# EAGLE design SmartGardenController (EAGLE 5.11)
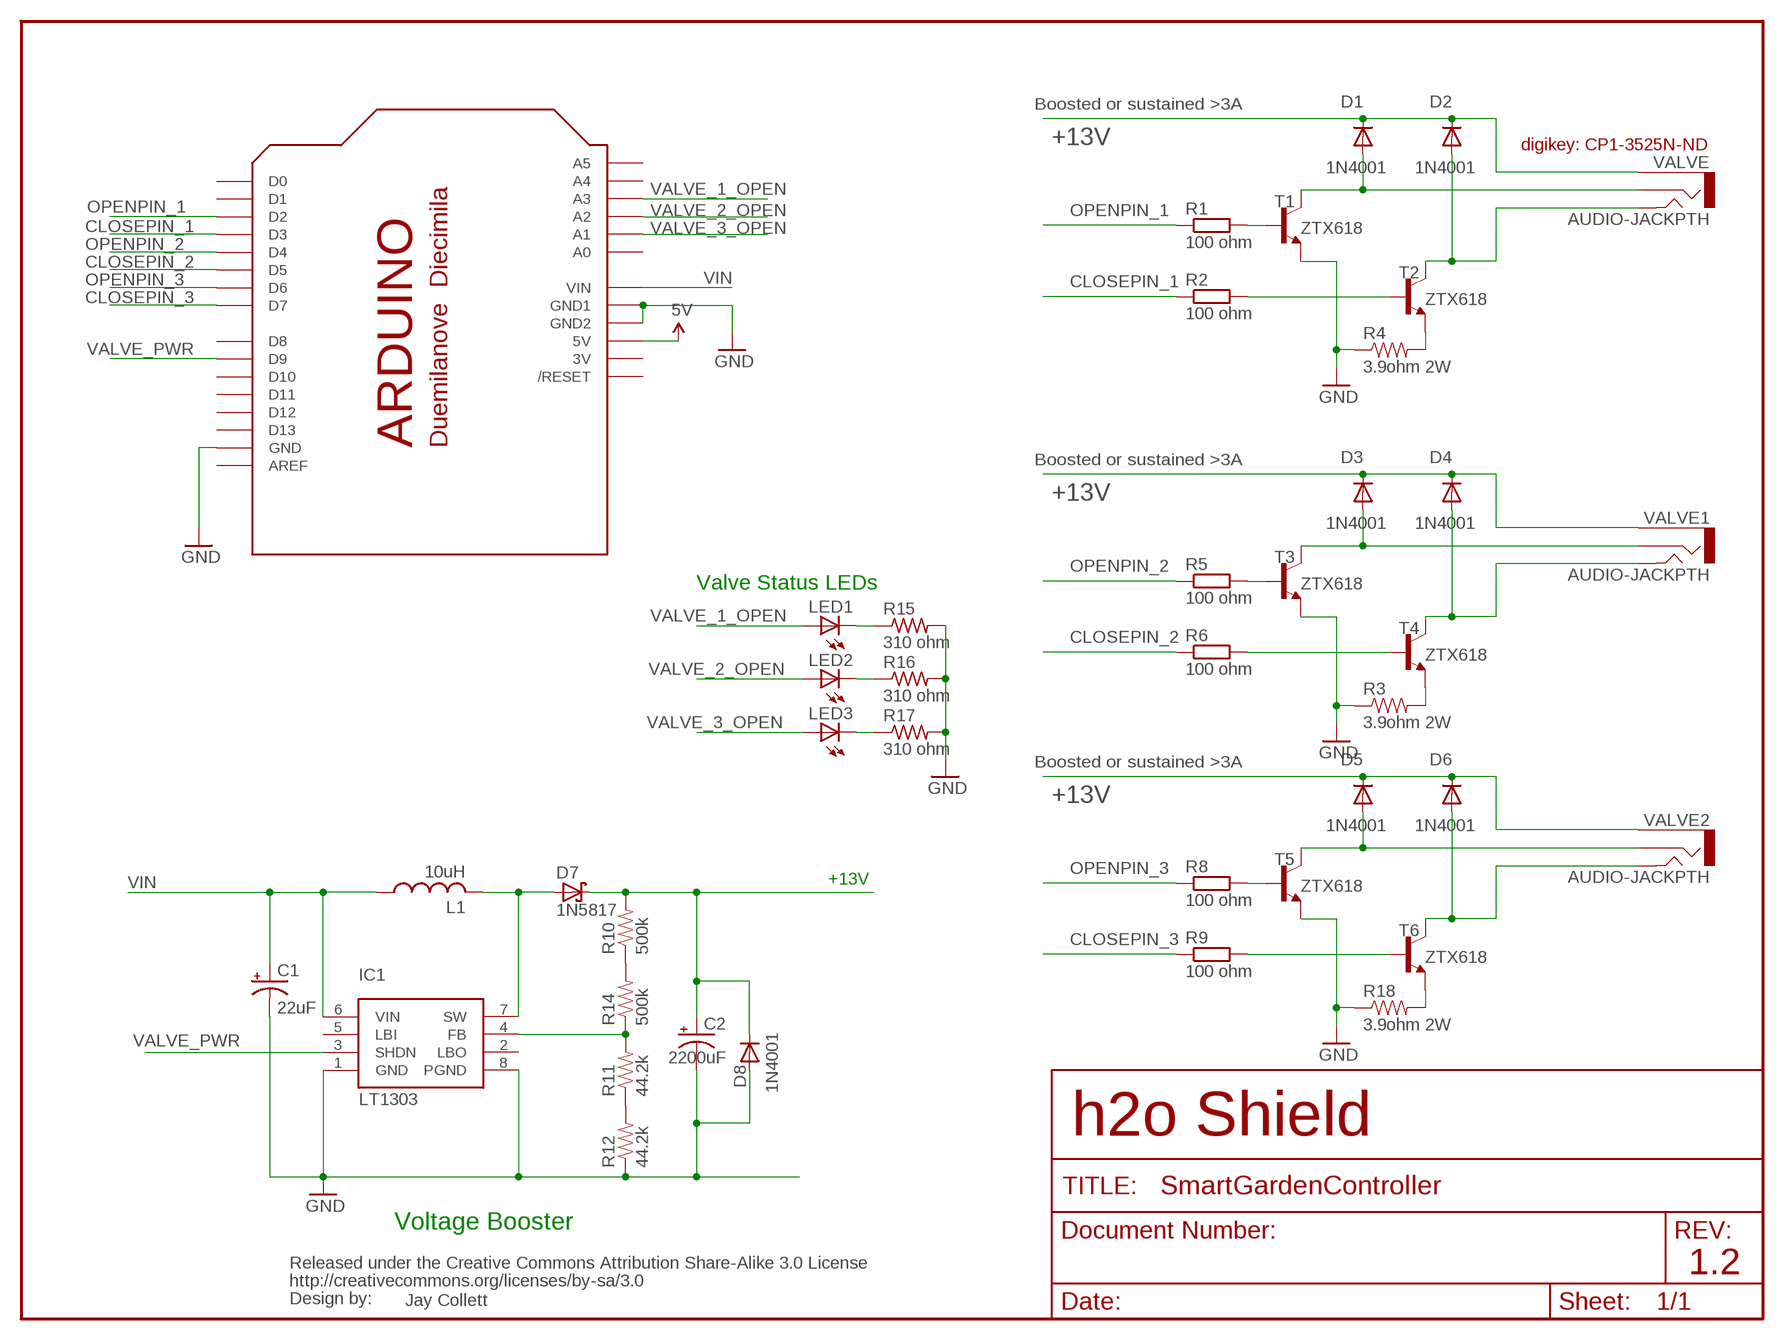
[diagram p0: schematic, sheet 1]

## Parts
C1  22uF  CPOL-USE2.5-5  [E2,5-5]
C2  2200uF  CPOL-USE5-13  [E5-13]
D1  1N4001  DIODEPTH  [DIODE-1N4001]
D2  1N4001  DIODEPTH  [DIODE-1N4001]
D3  1N4001  DIODEPTH  [DIODE-1N4001]
D4  1N4001  DIODEPTH  [DIODE-1N4001]
D5  1N4001  DIODEPTH  [DIODE-1N4001]
D6  1N4001  DIODEPTH  [DIODE-1N4001]
D7  1N5817  1N5817-T  [DO41-7.6]
D8  1N4001  1N4004  [DO41-10]
IC1  LT1303  [DIL08]
L1  10uH  L-US6000-XXX-RC  [6000-XXXX-RC]
LED1  LED0603  [LED-0603]
LED2  LED0603  [LED-0603]
LED3  LED0603  [LED-0603]
R1  100 ohm  R-EU_0204/7  [0204/7]
R2  100 ohm  R-EU_0204/7  [0204/7]
R3  3.9ohm 2W  RESISTORPTH-1W  [AXIAL-0.6]
R4  3.9ohm 2W  RESISTORPTH-1W  [AXIAL-0.6]
R5  100 ohm  R-EU_0204/7  [0204/7]
R6  100 ohm  R-EU_0204/7  [0204/7]
R8  100 ohm  R-EU_0204/7  [0204/7]
R9  100 ohm  R-EU_0204/7  [0204/7]
R10  500k  RESISTORAXIAL-0.3  [AXIAL-0.3]
R11  44.2k  RESISTORAXIAL-0.3  [AXIAL-0.3]
R12  44.2k  RESISTORAXIAL-0.3  [AXIAL-0.3]
R14  500k  RESISTORAXIAL-0.3  [AXIAL-0.3]
R15  310 ohm  R-US_0207/2V  [0207/2V]
R16  310 ohm  R-US_0207/2V  [0207/2V]
R17  310 ohm  R-US_0207/2V  [0207/2V]
R18  3.9ohm 2W  RESISTORPTH-1W  [AXIAL-0.6]
T1  ZTX618  2N2222  [TO92-EBC-OVAL]
T2  ZTX618  2N2222  [TO92-EBC-OVAL]
T3  ZTX618  2N2222  [TO92-EBC-OVAL]
T4  ZTX618  2N2222  [TO92-EBC-OVAL]
T5  ZTX618  2N2222  [TO92-EBC-OVAL]
T6  ZTX618  2N2222  [TO92-EBC-OVAL]
U$3  ARDUINOUNO  [ARDUINO]
U$4  CREATIVE_COMMONS  [CREATIVE_COMMONS]
VALVE  AUDIO-JACKPTH  [AUDIO-JACK]
VALVE1  AUDIO-JACKPTH  [AUDIO-JACK]
VALVE2  AUDIO-JACKPTH  [AUDIO-JACK]

## Nets
5V: U$3.5V
+13V [power]: C2.+ D1.C D2.C D3.C D4.C D5.C D6.C D7.C D8.C R10.P$2 VALVE1.1 VALVE2.1 VALVE.1
CLOSEPIN_1: R2.1 U$3.D3
CLOSEPIN_2: R6.1 U$3.D5
CLOSEPIN_3: R9.1 U$3.D7
GND [power]: C1.- C2.- D8.A IC1.1(GND) IC1.8(PGND) R3.P$1 R4.P$1 R12.P$1 R15.2 R16.2 R17.2 R18.P$1 T1.E T3.E T5.E U$3.GND U$3.GND1 U$3.GND2
N$1: D4.A T4.C VALVE1.5
N$2: D3.A T3.C VALVE1.2
N$3: R3.P$2 T4.E
N$4: R5.2 T3.B
N$5: R6.2 T4.B
N$6: D6.A T6.C VALVE2.5
N$7: D5.A T5.C VALVE2.2
N$8: D1.A T1.C VALVE.2
N$9: D2.A T2.C VALVE.5
N$10: R18.P$2 T6.E
N$11: R1.2 T1.B
N$12: R2.2 T2.B
N$13: R8.2 T5.B
N$14: R9.2 T6.B
N$15: R4.P$2 T2.E
N$16: IC1.4(FB) R11.P$2 R14.P$1
N$17: R10.P$1 R14.P$2
N$18: D7.A IC1.7(SW) L1.2
N$19: R11.P$1 R12.P$2
N$24: LED1.C R15.1
N$26: LED2.C R16.1
N$27: LED3.C R17.1
OPENPIN_1: R1.1 U$3.D2
OPENPIN_2: R5.1 U$3.D4
OPENPIN_3: R8.1 U$3.D6
VALVE_1_OPEN: LED1.A U$3.A3
VALVE_2_OPEN: LED2.A U$3.A2
VALVE_3_OPEN: LED3.A U$3.A1
VALVE_PWR: IC1.3(SHDN) U$3.D9
VIN: C1.+ IC1.6(VIN) L1.1 U$3.VIN
Unconnected: IC1.2(LBO) IC1.5(LBI) U$3.A0 U$3.A4 U$3.A5 U$3.AREF U$3.D0 U$3.D1 U$3.D8 U$3.D10 U$3.D11 U$3.D12 U$3.D13 U$3.RESET(/RESET)

## Notes on the sheet
- Boosted or sustained >3A
- digikey: CP1-3525N-ND
- Boosted or sustained >3A
- Valve Status LEDs
- Boosted or sustained >3A
- +13V
- h2o Shield
- Voltage Booster
- 1.2
- Jay Collett

## Power pins joined to a net without a drawn wire
3V: U$3.3V

## Library data of the parts
C1 C2 = rcl:CPOL-US: POLARIZED CAPACITOR, American symbol
D1-D6 = SparkFun:DIODE: Diode These are standard reverse protection diodes and small signal diodes. SMA package can handle up to about 1A. SOD-323 can handle about 200mA. What the SOD-323 package when ordering, there are some mfgs out there that are 5-pin packages.
D7 = diode:1N581*: 1.0A SCHOTTKY BARRIER RECTIFIER Source: http://www.diodes.com/datasheets/ds23001.pdf
D8 = diode:1N4004: DIODE general purpose rectifier, 1 A
IC1 = linear-technology:LT1303: LT1303 Micropower High Efficiency DC/DC Converter Source: http://www.linear.com/pc/downloadDocument.do?navId=H0,C1,C1003,C1042,C1031,C1061,P1035,D2445
L1 = rcl:L-US: INDUCTOR, American symbol
LED1-LED3 = SparkFun:LED: LEDs Standard schematic elements and footprints for 5mm, 3mm, 1206, and 0603 sized LEDs. 5mm - Spark Fun Electronics SKU : COM-00529 (and others)
R1 R2 R5 R6 R8 R9 = rcl:R-EU_: RESISTOR, European symbol
R3 R4 R10-R12 R14 R18 = SparkFun:RESISTOR: Resistor Basic schematic elements and footprints for 0603, 1206, and PTH resistors.
R15-R17 = adafruit:R-US_: RESISTOR, American symbol
T1-T6 = adafruit:2N2222: NPN TRANSISTOR Big oval pads
U$3 = adafruit:ARDUINO: Arduino Diecimila/Duemilanove Make a shield with ease, this package has all the named pins as well as the two mounting drill holes and an outline of the USB and DC power connector. The outline is on the DIMENSION layer, so if your board house uses it they will cut the outline to match. http://www.ladyada.net/library/pcb/eaglelibrary.html
U$4 = SparkFun:CREATIVE_COMMONS
VALVE VALVE1 VALVE2 = SparkFun:AUDIO-JACK: 3.5mm Audio Jack Simple 3.5mm common PCB mount audio jack. SKU: PRT-08032

## Net classes
0 default: width 0.406 mm, clearance 0.203 mm
1 power: width 0.61 mm, clearance 0.203 mm

## Board
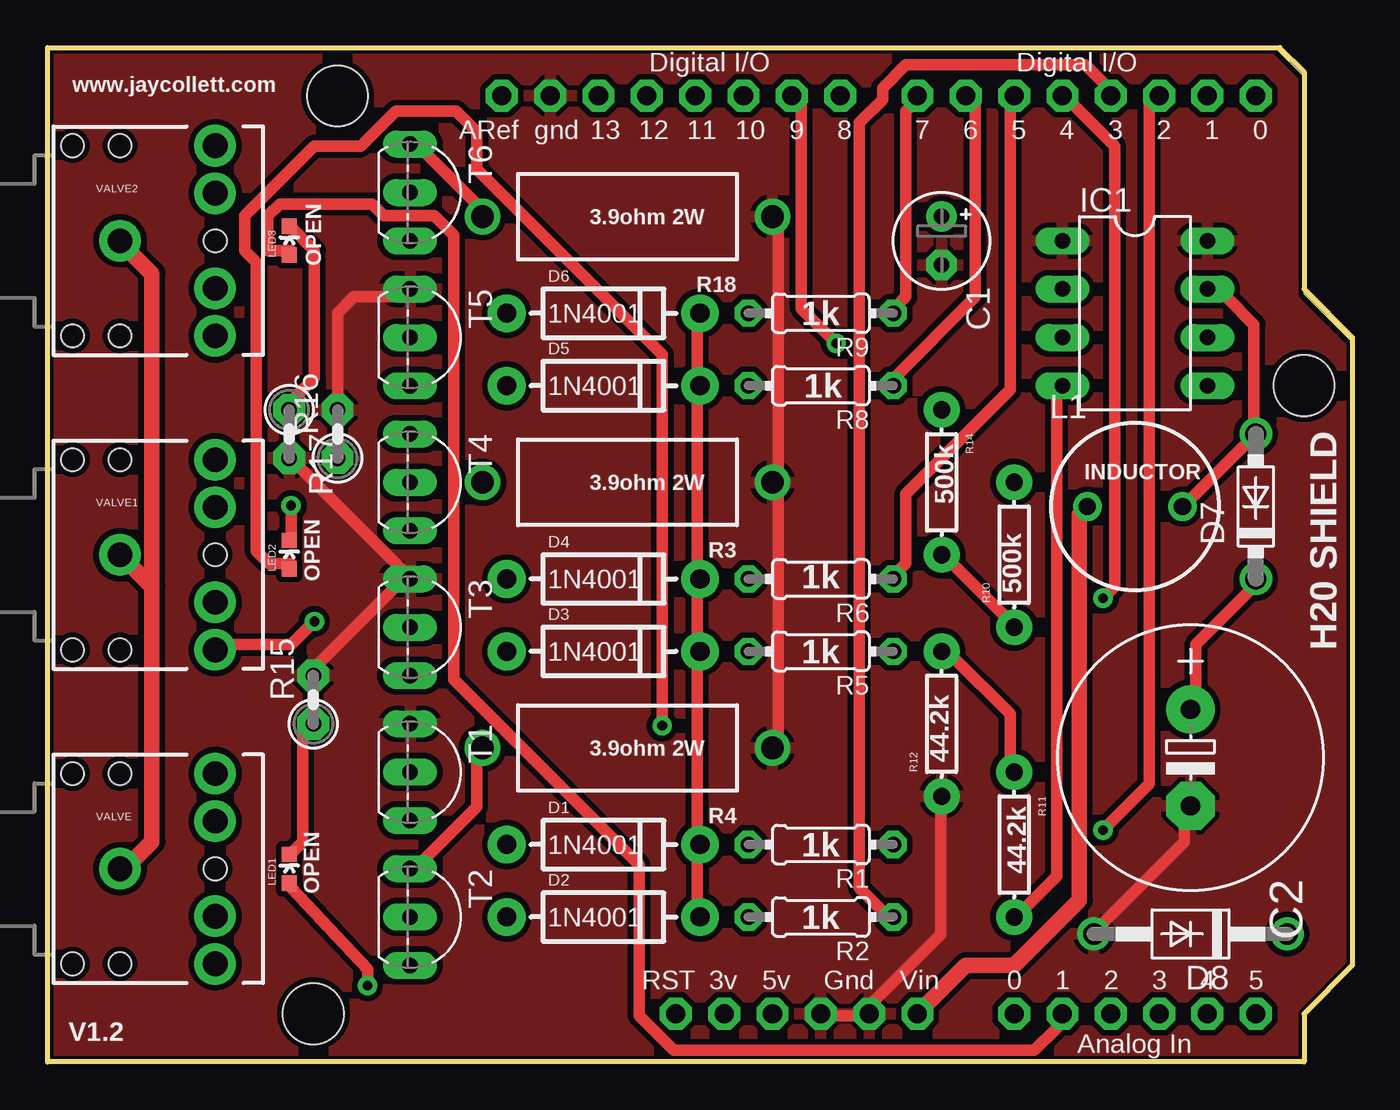
[diagram p1: board, top side]
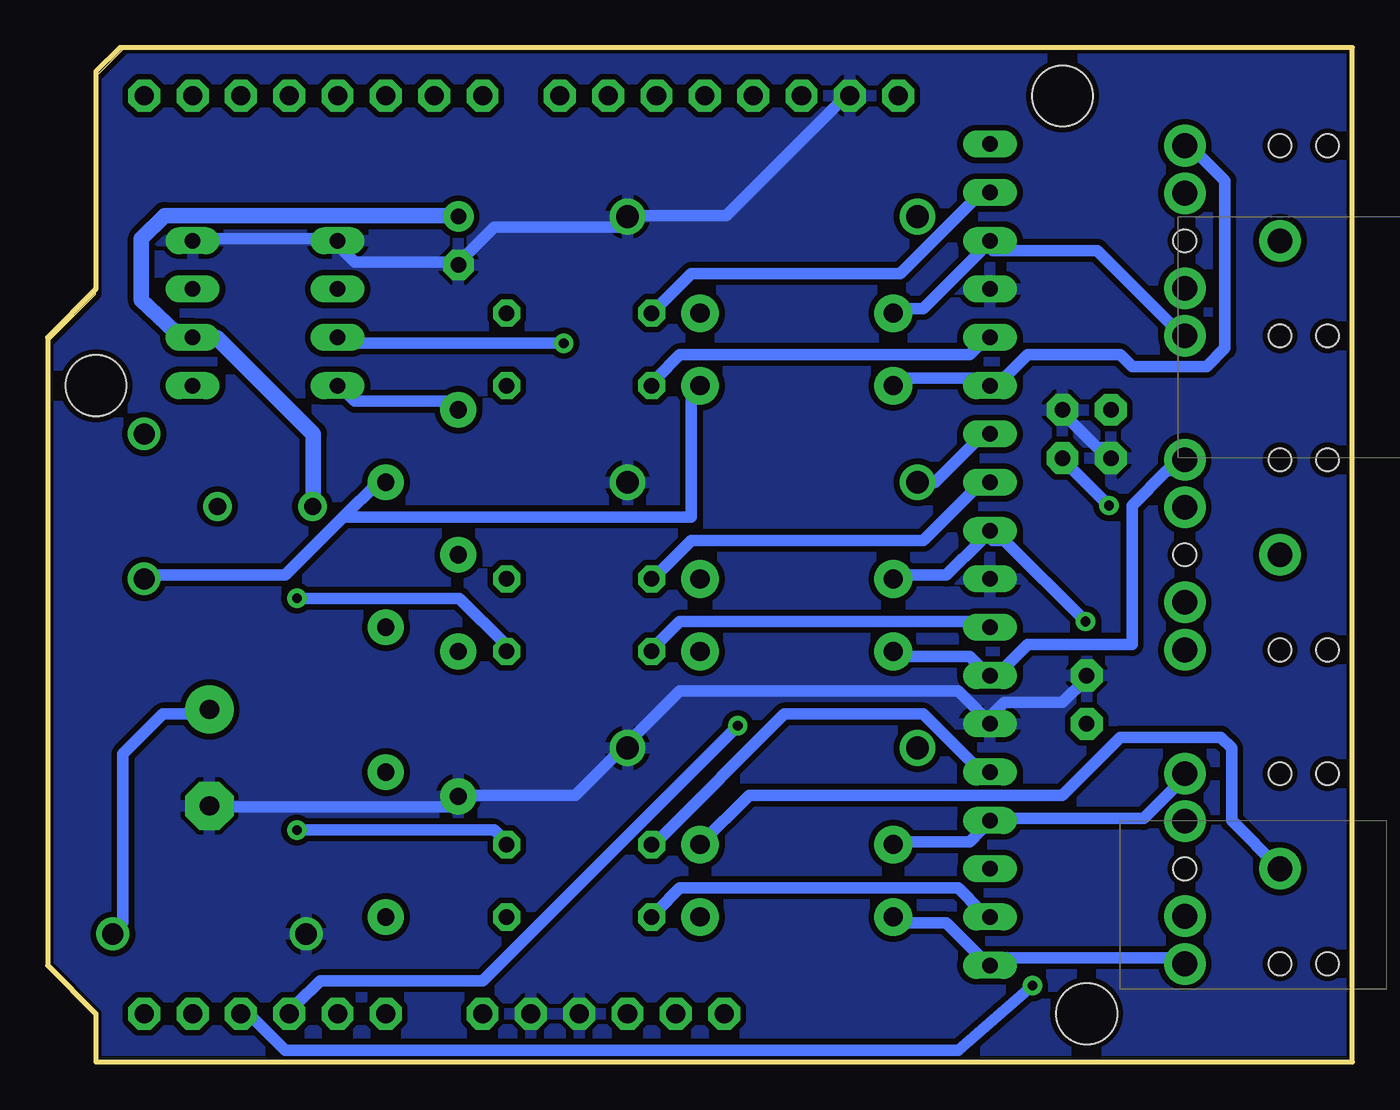
[diagram p2: board, bottom side, seen from below]

Size 68.58 x 53.34 mm. Coordinates in mm from the lower left corner, seen from the top.
Copper layers (1*16): Top 0.035mm / dielectric 1.5mm / Bottom 0.035mm
Design rules "SparkFun *": minimum track width 24mil, minimum drill 20mil, track to track 8mil, track to pad 8mil, pad to pad 8mil, via to via 8mil, smd to smd 8mil, copper to edge 10mil, drill to drill 8mil, minimum pad ring 12mil, minimum via ring 10mil, stop-mask expansion 4mil, vias tented up to drill 25mil, thermal gap 10mil
Milling: 9 lines

### Footprints (pad centres in the part's own frame; a part is rotated, then mirrored left to right if it is on the bottom)
E2,5-5 = drill 0.813 pad 1.6 round: + -1.27,0 | drill 0.813 pad 1.6 octagon: - 1.27,0
E5-13 = drill 1.016 pad 2.54 round: + -2.54,0 | drill 1.016 pad 2.54 octagon: - 2.54,0
DIODE-1N4001 = drill 1 pad 1.981 round: A -5.08,0; C 5.08,0
DO41-7.6 = drill 1.1 pad 1.7 round: A 3.81,0; C -3.81,0
DO41-10 = drill 1.118 round: A 5.08,0; C -5.08,0
DIL08 = drill 0.813 long: 1 -3.81,-3.81; 2 -1.27,-3.81; 3 1.27,-3.81; 4 3.81,-3.81; 5 3.81,3.81; 6 1.27,3.81; 7 -1.27,3.81; 8 -3.81,3.81
6000-XXXX-RC = drill 0.9 pad 1.422 round: 1 -2.5,0; 2 2.5,0
LED-0603 = smd 0.8 x 0.8: A 0,-0.75; C 0,0.75
0204/7 = drill 0.813 octagon: 1 -3.81,0; 2 3.81,0
AXIAL-0.6 = drill 1.2 pad 1.88 round: P$1 -7.62,0; P$2 7.62,0
AXIAL-0.3 = drill 0.9 pad 1.88 round: P$1 -3.81,0; P$2 3.81,0
0207/2V = drill 0.813 pad 1.676 octagon: 1 -1.27,0; 2 1.27,0
TO92-EBC-OVAL = drill 0.813 long: B 0,-1.27; C 2.54,-1.27; E -2.54,-1.27
ARDUINO = drill 1 pad 1.676 octagon: 3V 35.56,2.54; 5V 38.1,2.54; A0 50.8,2.54; A1 53.34,2.54; A2 55.88,2.54; A3 58.42,2.54; A4 60.96,2.54; A5 63.5,2.54; AREF 23.876,50.8; D0 63.5,50.8; D1 60.96,50.8; D2 58.42,50.8; D3 55.88,50.8; D4 53.34,50.8; D5 50.8,50.8; D6 48.26,50.8; D7 45.72,50.8; D8 41.656,50.8; D9 39.116,50.8; D10 36.576,50.8; D11 34.036,50.8; D12 31.496,50.8; D13 28.956,50.8; GND 26.416,50.8; GND1 43.18,2.54; GND2 40.64,2.54; RESET 33.02,2.54; VIN 45.72,2.54 | hole 3.2: 15.24,50.8; 66.04,35.56; 13.97,2.54
AUDIO-JACK = drill 1.3 pad 2.184 round: 1 0,0; 2 5,5; 3 5,2.5; 4 5,-2.5; 5 5,-5 | hole 1.2: 0,5; -2.5,5; -2.5,-5; 0,-5; 5,0

### Placement (x,y rotation side)
C1  46.99,43.18 270 top
C2  60.07,16 270 top
D1  29.21,11.43 0 top
D2  29.21,7.62 0 top
D3  29.21,21.59 0 top
D4  29.21,25.4 0 top
D5  29.21,35.56 0 top
D6  29.21,39.37 0 top
D7  63.5,29.21 90 top
D8  60.07,6.73 180 top
IC1  57.15,39.37 270 top
L1  57.15,29.21 0 top
LED1  12.7,10.16 0 top
LED2  12.7,26.67 0 top
LED3  12.7,43.18 0 top
R1  40.64,11.43 180 top
R2  40.64,7.62 180 top
R3  30.48,30.48 180 top
R4  30.48,16.51 180 top
R5  40.64,21.59 180 top
R6  40.64,25.4 180 top
R8  40.64,35.56 180 top
R9  40.64,39.37 180 top
R10  50.8,26.67 90 top
R11  50.8,11.43 270 top
R12  46.99,17.78 90 top
R14  46.99,30.48 270 top
R15  13.97,19.05 90 top
R16  15.24,33.02 90 top
R17  12.7,33.02 270 top
R18  30.48,44.45 180 top
T1  20.32,15.24 270 top
T2  20.32,7.62 270 top
T3  20.32,22.86 270 top
T4  20.32,30.48 270 top
T5  20.32,38.1 270 top
T6  20.32,45.72 270 top
U$3  0,0 0 top
U$4  8.89,1.27 0 top
VALVE  3.81,10.16 0 top
VALVE1  3.81,26.67 0 top
VALVE2  3.81,43.18 0 top

### Tracks (layer width: path | path; a pad name or v marks a point on that pad's centre or on a via)
+13V
  Top 0.61: D6.C 34.14,39.01 34.14,35.97 D5.C 34.14,35.36 34.14,25.6 D4.C 34.14,24.99 34.14,21.95 D3.C 34.14,21.34 34.14,11.58 D1.C 34.14,10.97 34.14,7.92 D2.C | D7.C 63.4,24.99 60.35,21.95 60.35,18.9 C2.+
  Top 0.813: 5.49,24.99 5.49,11.58 4.27,10.36 VALVE.1 | 5.49,24.99 VALVE1.1 | 5.49,24.99 5.49,41.45 4.27,42.67 VALVE2.1
  Bottom 0.61: D8.C 64.62,7.32 64.62,16.19 62.52,18.29 60.35,18.29 C2.+ | 53.03,28.65 56.08,25.6 63.4,25.6 D7.C | 53.03,28.65 51.21,30.48 R10.P$2 | 53.03,28.65 34.75,28.65 34.75,35.36 D5.C | 4.27,10.36 VALVE.1 6.35,12.7 6.35,16.51 6.91,17.07 12.19,17.07 15.24,14.02 31.7,14.02 D1.C
CLOSEPIN_1
  Top 0.61: R2.1 43.89,7.92 42.67,9.14 42.67,49.38 43.89,50.6 43.89,51.21 45.11,52.43 54.54,52.43 55.47,51.49 55.47,51.44 55.64,51.04 U$3.D3
CLOSEPIN_2
  Top 0.61: R6.1 44.5,25.6 45.11,26.21 45.11,29.87 50.6,35.36 50.6,50.6 U$3.D5
CLOSEPIN_3
  Top 0.61: R9.1 44.5,39.62 45.11,40.23 45.11,49.99 45.72,50.6 U$3.D7
GND
  Top 0.61: 38.41,30.48 38.41,43.89 R18.P$1 | T5.E 18.9,40.23 16.1,40.23 15.24,39.37 R16.2 | 18.9,25.6 12.8,31.7 R17.2 | 18.9,25.6 14.02,20.73 R15.2 | 18.9,25.6 T3.E | D8.A 55.47,7.32 59.74,11.58 59.74,13.41 C2.- | U$3.GND2 40.84,2.44 42.67,2.44 U$3.GND1 43.28,3.05 46.94,6.71 46.94,13.41 R12.P$1 | 38.41,30.48 38.41,17.07 R4.P$1 | 38.41,30.48 R3.P$1
  Bottom 0.61: IC1.8 60.96,43.28 53.65,43.28 IC1.1 53.03,42.67 52.43,42.06 47.55,42.06 C1.- 46.94,42.06 45.11,43.89 38.41,43.89 R18.P$1 37.8,44.5 32.92,44.5 26.82,50.6 U$3.GND | R15.2 14.02,20.12 15.24,18.9 18.29,18.9 18.9,18.29 T1.E 19.51,18.29 20.73,19.51 35.36,19.51 37.8,17.07 R4.P$1 38.41,16.46 40.84,14.02 46.94,14.02 R12.P$1 47.55,13.41 59.74,13.41 C2.- | R16.2 15.24,34.14 13.41,32.31 12.8,32.31 R17.2
  pour Bottom (isolate 0.305): 0,53.34 64.77,53.34 66.04,52.07 66.04,40.64 68.58,38.1 68.58,5.08 66.04,2.54 66.04,0 0,0
  pour Top (isolate 0.305): 0,53.34 64.77,53.34 66.04,52.07 66.04,40.64 68.58,38.1 68.58,5.08 66.04,2.54 66.04,0 0,0
N$1  (via drill 0.51)
  Top 0.61: v14.02,23.16 12.8,21.95 9.14,21.95 VALVE1.5
  Bottom 0.61: D4.A 23.77,25.6 21.34,25.6 19.51,27.43 T4.C 18.9,27.43 18.29,27.43 v14.02,23.16
N$2
  Bottom 0.61: D3.A 23.77,21.34 20.12,21.34 19.51,20.73 T3.C 18.9,20.73 18.29,20.73 17.07,21.95 11.58,21.95 11.58,29.26 9.75,31.09 9.14,31.09 VALVE1.2
N$3
  Bottom 0.61: T4.E 19.51,32.92 21.95,30.48 R3.P$2
N$4
  Bottom 0.61: T3.B 19.51,23.16 35.36,23.16 36.58,21.95 R5.2
N$5
  Bottom 0.61: T4.B 19.51,30.48 22.55,27.43 34.75,27.43 36.58,25.6 R6.2
N$6
  Bottom 0.61: D6.A 23.77,39.62 22.55,39.62 19.51,42.67 T6.C 18.9,42.67 13.41,42.67 9.14,38.41 VALVE2.5
N$7
  Bottom 0.61: D5.A 23.77,35.97 19.51,35.97 T5.C 18.9,35.97 18.29,35.97 17.07,37.19 12.19,37.19 11.58,36.58 7.66,36.58 6.71,37.52 6.71,46.33 8.53,48.16 VALVE2.2
N$8
  Bottom 0.61: D1.A 23.77,11.58 20.12,11.58 19.51,12.19 T1.C 18.9,12.8 10.97,12.8 9.14,14.63 VALVE.2
N$9
  Bottom 0.61: D2.A 23.77,7.32 21.34,7.32 19.51,5.49 T2.C 18.9,5.49 9.14,5.49 VALVE.5
N$10
  Top 0.61: T6.E 19.51,48.16 22.55,45.11 22.55,44.5 R18.P$2
N$11
  Bottom 0.61: T1.B 19.51,15.24 22.55,18.29 29.87,18.29 36.58,11.58 R1.2
N$12
  Bottom 0.61: T2.B 19.51,7.92 20.73,9.14 35.36,9.14 36.58,7.92 R2.2
N$13
  Bottom 0.61: T5.B 19.51,37.8 20.12,37.19 35.36,37.19 36.58,35.97 R8.2
N$14
  Bottom 0.61: T6.B 19.51,45.72 23.77,41.45 34.75,41.45 R9.2
N$15
  Top 0.61: T2.E 19.51,10.36 22.55,13.41 22.55,16.46 R4.P$2
N$16
  Top 0.61: R11.P$2 51.21,7.92 53.03,9.75 53.03,35.36 IC1.4
  Bottom 0.61: IC1.4 53.03,35.36 52.43,34.75 47.55,34.75 R14.P$1
N$17
  Top 0.61: R14.P$2 47.55,26.21 50.6,23.16 R10.P$1
N$18
  Top 0.61: IC1.7 60.96,40.23 61.95,40.23 63.4,38.78 63.4,33.53 D7.A 59.74,29.26 L1.2
N$19
  Top 0.61: R12.P$2 47.55,21.34 50.6,18.29 50.6,15.24 R11.P$1
N$24
  Top 0.61: LED1.C 12.8,10.97 13.41,11.58 13.41,17.68 R15.1
N$26  (via drill 0.51)
  Top 0.61: v12.8,29.26 12.8,27.43 LED2.C
  Bottom 0.61: v12.8,29.26 15.24,31.7 R16.1
N$27
  Top 0.61: LED3.C 12.8,43.89 14.02,42.67 14.02,35.97 12.8,34.75 R17.1
OPENPIN_1  (via drill 0.51)
  Top 0.61: v55.47,12.19 57.91,14.63 57.91,50.6 U$3.D2
  Bottom 0.61: v55.47,12.19 45.11,12.19 44.5,11.58 R1.1
OPENPIN_2  (via drill 0.51)
  Top 0.61: v55.47,24.38 56.08,24.99 56.08,48.16 53.65,50.6 U$3.D4
  Bottom 0.61: v55.47,24.38 46.94,24.38 44.5,21.95 R5.1
OPENPIN_3
  Top 0.61: R8.1 44.5,35.97 48.77,40.23 48.77,50.6 U$3.D6
VALVE_1_OPEN  (via drill 0.51)
  Top 0.61: v16.82,4.01 16.82,4.88 12.8,9.14 LED1.A
  Bottom 0.61: v16.82,4.01 20.73,0.61 56.08,0.61 57.91,2.44 U$3.A3
VALVE_2_OPEN  (via drill 0.51)
  Top 0.61: v32.31,17.68 32.31,37.19 22.55,46.94 22.55,48.92 21.49,49.99 18.29,49.99 16.46,48.16 14.02,48.16 10.36,44.5 10.36,42.67 10.97,42.06 10.97,26.86 11.62,26.21 12.8,26.21 LED2.A
  Bottom 0.61: v32.31,17.68 45.72,4.27 54.25,4.27 55.47,3.05 U$3.A2
VALVE_3_OPEN
  Top 0.61: LED3.A 12.8,42.67 11.58,42.67 11.58,44.5 12.19,45.11 17.07,45.11 17.68,44.5 20.32,44.5 21.34,43.48 21.34,20.12 31.09,10.36 31.09,2.44 32.92,0.61 51.87,0.61 53.03,1.78 53.03,2.44 U$3.A1
VALVE_PWR  (via drill 0.51)
  Top 0.61: v41.45,37.8 39.62,39.62 39.62,50.6 U$3.D9
  Bottom 0.61: v41.45,37.8 53.03,37.8 IC1.3
VIN
  Top 0.813: U$3.VIN 48.26,5.08 50.8,5.08 54.23,8.51 54.23,28.79 L1.1
  Bottom 0.813: C1.+ 47.55,44.5 62.43,44.5 63.65,43.28 63.65,40.05 61.88,38.41 60.96,38.41 IC1.6 59.69,38.1 54.61,33.02 54.61,29.21 L1.1

### Text on the board
tPlace: www.jaycollett.com | OPEN | 1k | 1k | H20 SHIELD | INDUCTOR | OPEN | 1k | 1k | 1k | OPEN | 1k | V1.2
ResistanceTop: 6.7mo 4.6 A | 1.4mo 4.6 A | 5.1mo 4.6 A | 2.1mo 6.0 A | 2.9mo 4.6 A | 2.9mo 4.6 A | 4.6mo 4.6 A | 1.5mo 6.0 A | 1.2mo 6.0 A | 7.2mo 4.6 A | 7.9mo 6.0 A | 1.1mo 4.6 A | 1.4mo 4.6 A | 6.6mo 4.6 A | 1.1mo 4.6 A | 8.0mo 4.6 A | 1.1mo 6.0 A | 7.0mo 4.6 A | 7.0mo 4.6 A | 1.6mo 6.0 A | 1.1mo 4.6 A | 4.9mo 6.0 A | 1.8mo 4.6 A | 3.2mo 6.0 A | 1.4mo 6.7 A | 6.9mo 6.0 A | 2.0mo 4.6 A | 4.1mo 4.6 A | 3.0mo 6.0 A | 6.0mo 6.7 A | 4.9mo 6.0 A | 4.2mo 4.6 A | 5.6mo 4.6 A | 14.1mo 4.6 A | 1.6mo 6.0 A | 3.7mo 6.7 A | 1.5mo 6.0 A | 1.1mo 6.0 A | 2.3mo 4.6 A | 3.6mo 6.7 A | 2.9mo 4.6 A | 1.1mo 6.0 A | 2.4mo 4.6 A | 2.4mo 4.6 A | 21.1mo 4.6 A | 1.1mo 6.0 A | 1.1mo 4.6 A | 1.1mo 4.6 A | 8.7mo 4.6 A | 2.6mo 6.7 A | 1.4mo 6.7 A | 26.4mo 4.6 A | 1.1mo 4.6 A | 4.3mo 4.6 A | 3.3mo 6.0 A | 5.0mo 6.7 A | 3.7mo 6.7 A | 1.2mo 6.0 A | 1.4mo 4.6 A | 3.7mo 6.7 A | 2.4mo 6.0 A | 5.4mo 4.6 A | 2.6mo 6.0 A | 6.2mo 4.6 A | 1.1mo 6.0 A | 3.9mo 4.6 A | 1.8mo 4.6 A | 2.3mo 4.6 A | 1.4mo 6.7 A | 3.0mo 4.6 A | 6.6mo 4.6 A | 4.8mo 4.6 A | 3.0mo 6.0 A | 4.5mo 6.0 A | 1.1mo 4.6 A | 1.6mo 4.6 A | 21.6mo 4.6 A | 1.3mo 4.6 A
ResistanceBottom: 9.0mo 4.6 A | 1.1mo 4.6 A | 2.3mo 4.6 A | 4.8mo 4.6 A | 8.0mo 4.6 A | 1.1mo 4.6 A | 4.2mo 4.6 A | 2.3mo 6.0 A | 1.1mo 4.6 A | 4.3mo 4.6 A | 1.4mo 4.6 A | 1.6mo 4.6 A | 3.2mo 6.0 A | 3.5mo 4.6 A | 5.6mo 4.6 A | 3.4mo 4.6 A | 3.5mo 4.6 A | 2.7mo 4.6 A | 3.4mo 4.6 A | 4.3mo 4.6 A | 4.1mo 4.6 A | 2.7mo 4.6 A | 4.5mo 4.6 A | 1.8mo 4.6 A | 9.3mo 4.6 A | 1.8mo 4.6 A | 3.2mo 4.6 A | 6.0mo 6.7 A | 9.5mo 4.6 A | 4.1mo 6.7 A | 2.3mo 4.6 A | 3.4mo 6.7 A | 2.2mo 4.6 A | 1.5mo 4.6 A | 1.1mo 4.6 A | 1.5mo 6.7 A | 3.2mo 4.6 A | 7.5mo 4.6 A | 2.7mo 4.6 A | 1.1mo 4.6 A | 1.1mo 6.7 A | 2.3mo 4.6 A | 8.8mo 4.6 A | 2.4mo 4.6 A | 4.5mo 4.6 A | 3.4mo 4.6 A | 1.6mo 4.6 A | 6.2mo 4.6 A | 5.2mo 4.6 A | 10.9mo 4.6 A | 2.4mo 4.6 A | 4.6mo 6.7 A | 7.4mo 4.6 A | 1.1mo 4.6 A | 9.5mo 4.6 A | 6.4mo 6.0 A | 1.6mo 4.6 A | 7.2mo 4.6 A | 2.0mo 4.6 A | 11.1mo 4.6 A | 12.5mo 4.6 A | 5.0mo 4.6 A | 1.1mo 4.6 A | 10.9mo 4.6 A | 2.4mo 4.6 A | 9.1mo 4.6 A | 1.6mo 4.6 A | 1.9mo 4.6 A | 1.6mo 4.6 A | 6.4mo 4.6 A | 2.3mo 4.6 A | 4.3mo 4.6 A | 1.1mo 4.6 A | 2.5mo 4.6 A | 1.1mo 6.0 A | 23.6mo 4.6 A | 1.1mo 4.6 A